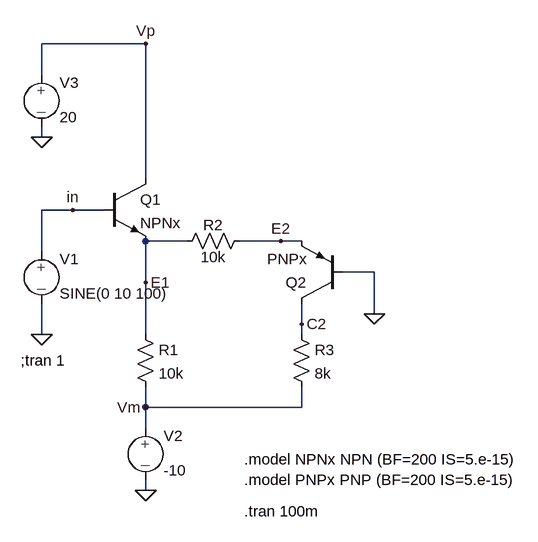
[diagram p0: schematic Klausur_10.1.asc]
Klausur_10.1.asc, the LTspice schematic file:
Version 4
SHEET 1 880 680
WIRE -784 -176 -944 -176
WIRE -944 -128 -944 -176
WIRE -944 -32 -944 -48
WIRE -784 32 -784 -176
WIRE -896 80 -944 80
WIRE -848 80 -896 80
WIRE -720 128 -784 128
WIRE -576 128 -640 128
WIRE -544 128 -576 128
WIRE -944 144 -944 80
WIRE -432 176 -480 176
WIRE -784 192 -784 128
WIRE -432 240 -432 176
WIRE -544 256 -544 224
WIRE -944 272 -944 224
WIRE -784 272 -784 192
WIRE -544 272 -544 256
WIRE -784 384 -784 352
WIRE -544 384 -544 352
WIRE -544 384 -784 384
WIRE -784 416 -784 384
WIRE -784 512 -784 496
FLAG -944 272 0
FLAG -784 512 0
FLAG -944 -32 0
FLAG -432 240 0
FLAG -784 -176 Vp
FLAG -784 384 Vm
FLAG -544 256 C2
FLAG -784 192 E1
FLAG -576 128 E2
FLAG -896 80 in
SYMBOL source-V -944 128 R0
WINDOW 123 0 0 Left 0
WINDOW 39 0 0 Left 0
SYMATTR InstName V1
SYMATTR Value SINE(0 10 100)
SYMBOL source-V -784 400 R0
WINDOW 123 0 0 Left 0
WINDOW 39 0 0 Left 0
SYMATTR InstName V2
SYMATTR Value -10
SYMBOL EIT_Semiconductors\\npn -848 32 R0
SYMATTR InstName Q1
SYMATTR Value NPNx
SYMBOL EIT_Semiconductors\\pnp -480 224 R180
SYMATTR InstName Q2
SYMATTR Value PNPx
SYMBOL res -624 112 R90
WINDOW 0 7 56 VBottom 0
WINDOW 3 25 56 VTop 0
SYMATTR InstName R2
SYMATTR Value 10k
SYMBOL source-V -944 -144 R0
WINDOW 123 0 0 Left 0
WINDOW 39 0 0 Left 0
SYMATTR InstName V3
SYMATTR Value 20
SYMBOL res -800 256 R0
SYMATTR InstName R1
SYMATTR Value 10k
SYMBOL res -560 256 R0
SYMATTR InstName R3
SYMATTR Value 8k
TEXT -632 464 Left 0 !.model NPNx NPN (BF=200 IS=5.e-15)
TEXT -632 496 Left 0 !.model PNPx PNP (BF=200 IS=5.e-15)
TEXT -976 312 Left 0 !;tran 1
TEXT -632 544 Left 0 !.tran 100m

The netlist it stands for:
* Klausur_10.1.asc
V1 in 0 SINE(0 10 100)
V2 Vm 0 -10
Q1 Vp in E1 0 NPNx
Q2 C2 0 E2 0 PNPx
R2 E2 E1 10k
V3 Vp 0 20
R1 E1 Vm 10k
R3 C2 Vm 8k
.model NPN NPN
.model PNP PNP
.lib standard.bjt
.model NPNx NPN (BF=200 IS=5.e-15)
.model PNPx PNP (BF=200 IS=5.e-15)
;tran 1
.tran 100m
.backanno
.end